# Altium schematic sheet Table of Contents.SchDoc
size A4; Organization: BrickRed Systems; Address1: 2509 152nd Ave NE; Address2: Suite B; Address3: Redmond, WA 98052; SheetNumber: 2; SheetTotal: 6; PageSetup: Record=PageOptions|CenterHorizontal=True|CenterVertical=True|PrintScale=1.00|XCorrection=1.00|YCorrection=1.00|PrintKind=1|BorderSize=5000000|LeftOffset=0|BottomOffset=0|Orientation=2|PaperLength=1000|PaperWidth=1000|Scale=100|PaperSource=7|PrintQuality=600|MediaType=1|DitherType=10|PaperKind=Letter|PrintScaleMode=1
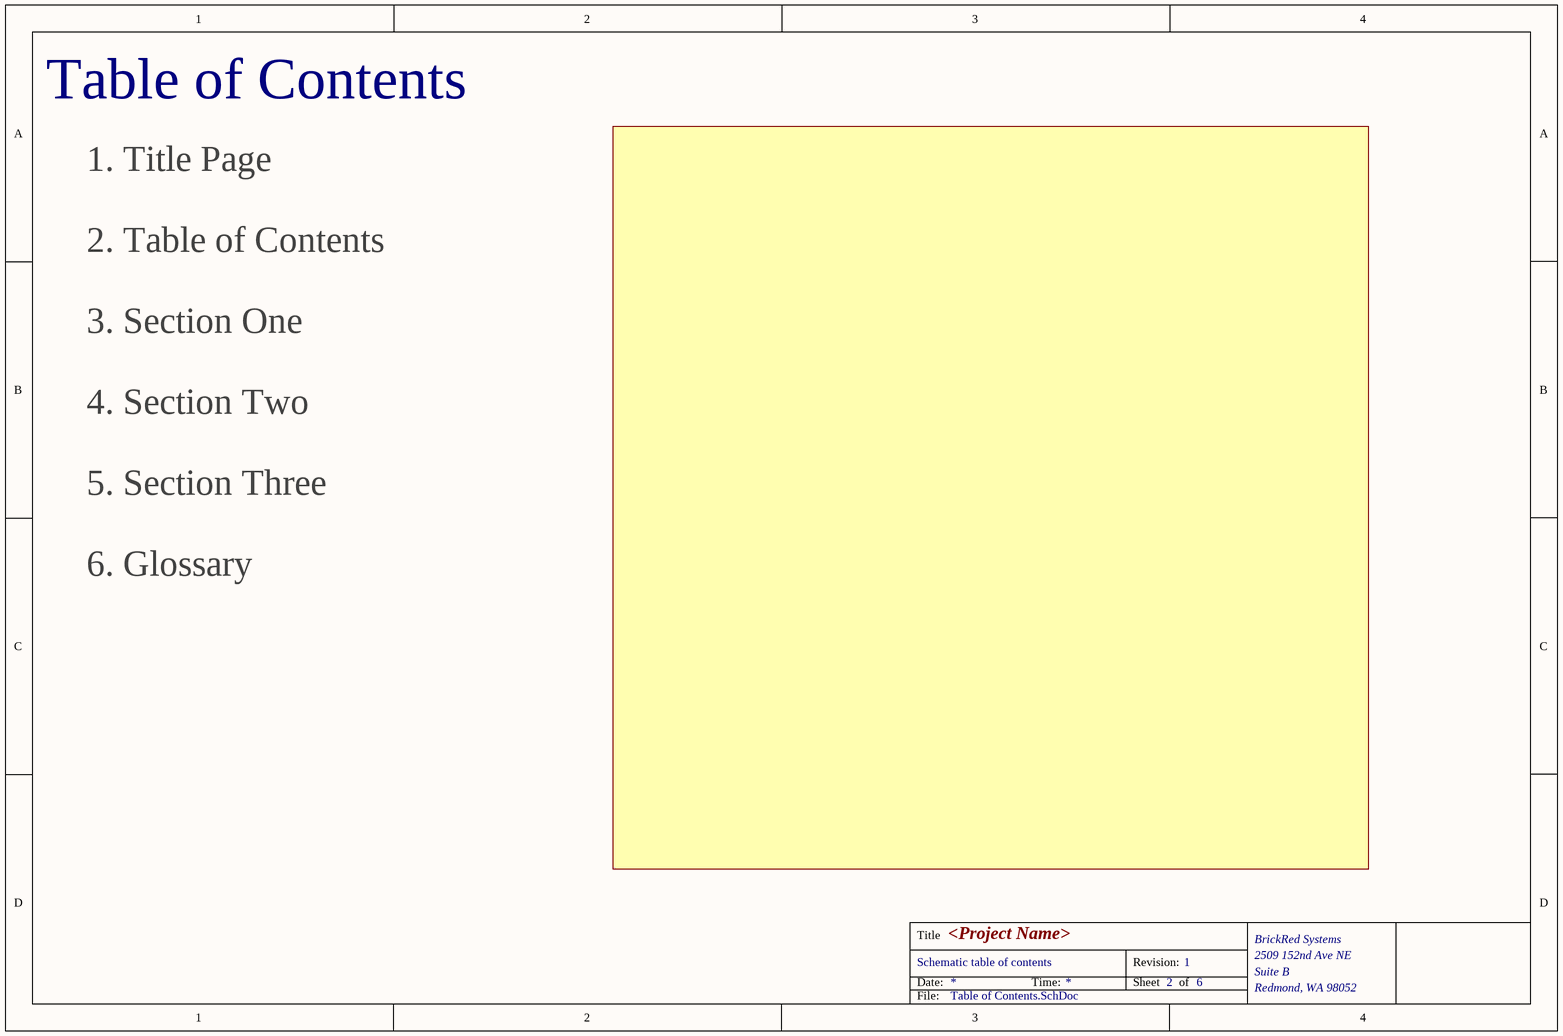
[diagram p0: Table of Contents.SchDoc]

## Notes on the sheet
- Table of Contents
- 1. Title Page
- 2. Table of Contents
- 3. Section One
- 4. Section Two
- 5. Section Three
- 6. Glossary
- Title
- Date:
- Schematic table of contents
- <Project Name>
- Time:
- Revision:
- Sheet
- of
- 1
- File: